# Altium project SQUIDCtr_Rev0.PrjPCB (part 1 of 2)
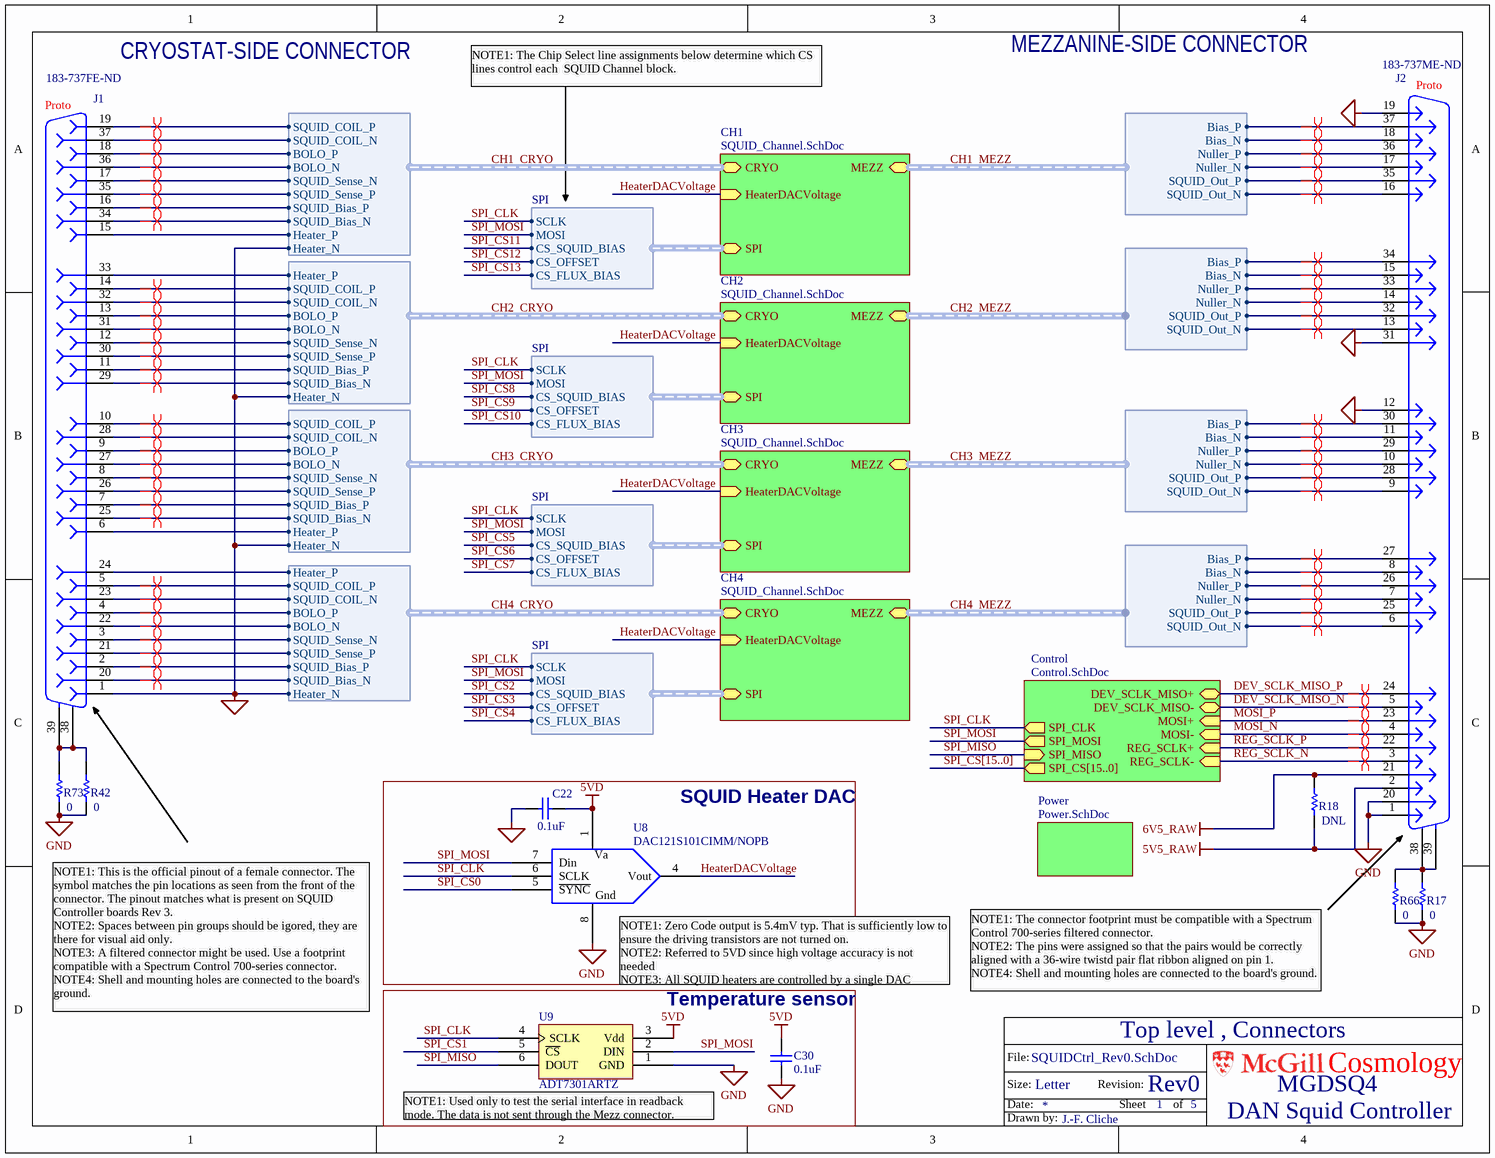
[diagram p0: SQUIDCtrl_Rev0.SchDoc]
ModelNumber: MGDSQ4; ProjectTitle: DAN Squid Controller
5 sheets, 584 parts. Net scope: hierarchical (ports join the sheet entries above them; power ports are global).
Board file: SQUIDCtr_Rev0.PcbDoc
Sheets:
  SQUIDCtrl_Rev0.SchDoc
    CH1 = SQUID_Channel.SchDoc
      REFS = SQUID_Channel_DACS.SchDoc
    Power = Power.SchDoc
    Control = Control.SchDoc
    CH2 = SQUID_Channel.SchDoc
      REFS = SQUID_Channel_DACS.SchDoc
    CH3 = SQUID_Channel.SchDoc
      REFS = SQUID_Channel_DACS.SchDoc
    CH4 = SQUID_Channel.SchDoc
      REFS = SQUID_Channel_DACS.SchDoc

## Sheet SQUIDCtrl_Rev0.SchDoc: Top level , Connectors
size Letter; DrawnBy: J.-F. Cliche; Engineer: J.-F. Cliche; Organization: McGill University; DocumentNumber: 1; Revision: Rev0; SheetNumber: 1; SheetTotal: 5; PageSetup: Record=PageOptions|CenterHorizontal=True|CenterVertical=True|PrintScale=0.96|XCorrection=1.00|YCorrection=1.00|PrintKind=0|BorderSize=5000000|LeftOffset=0|BottomOffset=0|Orientation=2|PaperLength=1000|PaperWidth=1000|Scale=100|PaperSource=7|PrintQuality=-4|MediaType=1|DitherType=10|PaperKind=Letter (8.5 x 11")|PrintScaleMode=1; ProjectTitle: DAN Squid Controller; ProjectName: CSA FMUX

### Parts
C22  0.1uF  [0603]
C30  0.1uF  [0603]
J1  Symbol status: Proto  Supplier Part Number 1: 183-737FE-ND  [DSUB37-F (590mils)]  (hidden comment: DB37F_Resize)
J2  Symbol status: Proto  Supplier Part Number 1: 183-737ME-ND  [DSUB37-M (590mils)]  (hidden comment: DB37M_Resize)
R17  0  [0603]
R18  DNL  [0603]
R42  0  [0603]
R66  0  [0603]
R73  0  [0603]
U8  DAC121S101CIMM/NOPB  [MSOP-8]
U9  ADT7301ARTZ  [SOT23-6]

### Blocks framed on the sheet
SQUID Heater DAC: C22 U8
Temperature sensor: C30 U9

### Sub-sheets
CH1 = SQUID_Channel.SchDoc: CRYO (harness SQUID_CH_IN), MEZZ (harness SQUID_CH_OUT), SPI (harness SPI), HeaterDACVoltage (in)
CH2 = SQUID_Channel.SchDoc: CRYO (harness SQUID_CH_IN), MEZZ (harness SQUID_CH_OUT), SPI (harness SPI), HeaterDACVoltage (in)
CH3 = SQUID_Channel.SchDoc: CRYO (harness SQUID_CH_IN), MEZZ (harness SQUID_CH_OUT), SPI (harness SPI), HeaterDACVoltage (in)
CH4 = SQUID_Channel.SchDoc: CRYO (harness SQUID_CH_IN), MEZZ (harness SQUID_CH_OUT), SPI (harness SPI), HeaterDACVoltage (in)
Control = Control.SchDoc: REG_SCLK+ (in), MOSI+ (in), REG_SCLK- (in), MOSI- (in), DEV_SCLK_MISO+ (bidir), DEV_SCLK_MISO- (bidir), SPI_CLK (out), SPI_MOSI (out), SPI_CS[15..0] (out), SPI_MISO (in)
Power = Power.SchDoc: no entries

### Harnesses
SQUID_CH_IN: SQUID_COIL_P, SQUID_COIL_N, BOLO_P, BOLO_N, SQUID_Sense_P, SQUID_Bias_P, SQUID_Bias_N, Heater_P, SQUID_Sense_N, Heater_N
SQUID_CH_OUT: Bias_P, Bias_N, Nuller_P, Nuller_N, SQUID_Out_P, SQUID_Out_N
SPI: SCLK, MOSI, CS_SQUID_BIAS, CS_OFFSET, CS_FLUX_BIAS

### Nets
5V5_RAW: J2.2 R18.1
5VD: C22.2 C30.2 U8.1(Va) U9.3(Vdd)
6V5_RAW: J2.21 R18.2
GND: C22.1 C30.1 J1.1 J2.1 J2.12 J2.19 J2.20 J2.31 R17.1 R42.1 R66.1 R73.1 U8.8(Gnd) U9.1(GND) ; sheet CH1/CRYO.Heater_N, sheet CH2/CRYO.Heater_N, sheet CH3/CRYO.Heater_N, sheet CH4/CRYO.Heater_N
CH1_CRYO.BOLO_N: J1.36 ; sheet CH1/CRYO.BOLO_N
CH1_CRYO.BOLO_P: J1.18 ; sheet CH1/CRYO.BOLO_P
CH1_CRYO.Heater_P: J1.15 ; sheet CH1/CRYO.Heater_P
CH1_CRYO.SQUID_Bias_N: J1.34 ; sheet CH1/CRYO.SQUID_Bias_N
CH1_CRYO.SQUID_Bias_P: J1.16 ; sheet CH1/CRYO.SQUID_Bias_P
CH1_CRYO.SQUID_COIL_N: J1.37 ; sheet CH1/CRYO.SQUID_COIL_N
CH1_CRYO.SQUID_COIL_P: J1.19 ; sheet CH1/CRYO.SQUID_COIL_P
CH1_CRYO.SQUID_Sense_N: J1.17 ; sheet CH1/CRYO.SQUID_Sense_N
CH1_CRYO.SQUID_Sense_P: J1.35 ; sheet CH1/CRYO.SQUID_Sense_P
CH1_MEZZ.Bias_N: J2.18 ; sheet CH1/MEZZ.Bias_N
CH1_MEZZ.Bias_P: J2.37 ; sheet CH1/MEZZ.Bias_P
CH1_MEZZ.Nuller_N: J2.17 ; sheet CH1/MEZZ.Nuller_N
CH1_MEZZ.Nuller_P: J2.36 ; sheet CH1/MEZZ.Nuller_P
CH1_MEZZ.SQUID_Out_N: J2.16 ; sheet CH1/MEZZ.SQUID_Out_N
CH1_MEZZ.SQUID_Out_P: J2.35 ; sheet CH1/MEZZ.SQUID_Out_P
CH2_CRYO.BOLO_N: J1.31 ; sheet CH2/CRYO.BOLO_N
CH2_CRYO.BOLO_P: J1.13 ; sheet CH2/CRYO.BOLO_P
CH2_CRYO.Heater_P: J1.33 ; sheet CH2/CRYO.Heater_P
CH2_CRYO.SQUID_Bias_N: J1.29 ; sheet CH2/CRYO.SQUID_Bias_N
CH2_CRYO.SQUID_Bias_P: J1.11 ; sheet CH2/CRYO.SQUID_Bias_P
CH2_CRYO.SQUID_COIL_N: J1.32 ; sheet CH2/CRYO.SQUID_COIL_N
CH2_CRYO.SQUID_COIL_P: J1.14 ; sheet CH2/CRYO.SQUID_COIL_P
CH2_CRYO.SQUID_Sense_N: J1.12 ; sheet CH2/CRYO.SQUID_Sense_N
CH2_CRYO.SQUID_Sense_P: J1.30 ; sheet CH2/CRYO.SQUID_Sense_P
CH2_MEZZ.Bias_N: J2.15 ; sheet CH2/MEZZ.Bias_N
CH2_MEZZ.Bias_P: J2.34 ; sheet CH2/MEZZ.Bias_P
CH2_MEZZ.Nuller_N: J2.14 ; sheet CH2/MEZZ.Nuller_N
CH2_MEZZ.Nuller_P: J2.33 ; sheet CH2/MEZZ.Nuller_P
CH2_MEZZ.SQUID_Out_N: J2.13 ; sheet CH2/MEZZ.SQUID_Out_N
CH2_MEZZ.SQUID_Out_P: J2.32 ; sheet CH2/MEZZ.SQUID_Out_P
CH3_CRYO.BOLO_N: J1.27 ; sheet CH3/CRYO.BOLO_N
CH3_CRYO.BOLO_P: J1.9 ; sheet CH3/CRYO.BOLO_P
CH3_CRYO.Heater_P: J1.6 ; sheet CH3/CRYO.Heater_P
CH3_CRYO.SQUID_Bias_N: J1.25 ; sheet CH3/CRYO.SQUID_Bias_N
CH3_CRYO.SQUID_Bias_P: J1.7 ; sheet CH3/CRYO.SQUID_Bias_P
CH3_CRYO.SQUID_COIL_N: J1.28 ; sheet CH3/CRYO.SQUID_COIL_N
CH3_CRYO.SQUID_COIL_P: J1.10 ; sheet CH3/CRYO.SQUID_COIL_P
CH3_CRYO.SQUID_Sense_N: J1.8 ; sheet CH3/CRYO.SQUID_Sense_N
CH3_CRYO.SQUID_Sense_P: J1.26 ; sheet CH3/CRYO.SQUID_Sense_P
CH3_MEZZ.Bias_N: J2.11 ; sheet CH3/MEZZ.Bias_N
CH3_MEZZ.Bias_P: J2.30 ; sheet CH3/MEZZ.Bias_P
CH3_MEZZ.Nuller_N: J2.10 ; sheet CH3/MEZZ.Nuller_N
CH3_MEZZ.Nuller_P: J2.29 ; sheet CH3/MEZZ.Nuller_P
CH3_MEZZ.SQUID_Out_N: J2.9 ; sheet CH3/MEZZ.SQUID_Out_N
CH3_MEZZ.SQUID_Out_P: J2.28 ; sheet CH3/MEZZ.SQUID_Out_P
CH4_CRYO.BOLO_N: J1.22 ; sheet CH4/CRYO.BOLO_N
CH4_CRYO.BOLO_P: J1.4 ; sheet CH4/CRYO.BOLO_P
CH4_CRYO.Heater_P: J1.24 ; sheet CH4/CRYO.Heater_P
CH4_CRYO.SQUID_Bias_N: J1.20 ; sheet CH4/CRYO.SQUID_Bias_N
CH4_CRYO.SQUID_Bias_P: J1.2 ; sheet CH4/CRYO.SQUID_Bias_P
CH4_CRYO.SQUID_COIL_N: J1.23 ; sheet CH4/CRYO.SQUID_COIL_N
CH4_CRYO.SQUID_COIL_P: J1.5 ; sheet CH4/CRYO.SQUID_COIL_P
CH4_CRYO.SQUID_Sense_N: J1.3 ; sheet CH4/CRYO.SQUID_Sense_N
CH4_CRYO.SQUID_Sense_P: J1.21 ; sheet CH4/CRYO.SQUID_Sense_P
CH4_MEZZ.Bias_N: J2.8 ; sheet CH4/MEZZ.Bias_N
CH4_MEZZ.Bias_P: J2.27 ; sheet CH4/MEZZ.Bias_P
CH4_MEZZ.Nuller_N: J2.7 ; sheet CH4/MEZZ.Nuller_N
CH4_MEZZ.Nuller_P: J2.26 ; sheet CH4/MEZZ.Nuller_P
CH4_MEZZ.SQUID_Out_N: J2.6 ; sheet CH4/MEZZ.SQUID_Out_N
CH4_MEZZ.SQUID_Out_P: J2.25 ; sheet CH4/MEZZ.SQUID_Out_P
DEV_SCLK_MISO_N: J2.5 ; sheet Control/DEV_SCLK_MISO-
DEV_SCLK_MISO_P: J2.24 ; sheet Control/DEV_SCLK_MISO+
HeaterDACVoltage: U8.4(Vout) ; sheet CH1/HeaterDACVoltage, sheet CH2/HeaterDACVoltage, sheet CH3/HeaterDACVoltage, sheet CH4/HeaterDACVoltage
MOSI_N: J2.4 ; sheet Control/MOSI-
MOSI_P: J2.23 ; sheet Control/MOSI+
REG_SCLK_N: J2.3 ; sheet Control/REG_SCLK-
REG_SCLK_P: J2.22 ; sheet Control/REG_SCLK+
SPI_CLK: U8.6(SCLK) U9.4(SCLK) ; sheet Control/SPI_CLK, sheet CH1/SPI.SCLK, sheet CH2/SPI.SCLK, sheet CH3/SPI.SCLK, sheet CH4/SPI.SCLK
SPI_CS0: U8.5(~{SYNC})
SPI_CS1: U9.5(~{CS})
SPI_MISO: U9.6(DOUT) ; sheet Control/SPI_MISO
SPI_MOSI: U8.7(Din) U9.2(DIN) ; sheet Control/SPI_MOSI, sheet CH1/SPI.MOSI, sheet CH2/SPI.MOSI, sheet CH3/SPI.MOSI, sheet CH4/SPI.MOSI
NetJ1_38: J1.38(MH1) J1.39(MH2) R42.2 R73.2
NetJ2_38: J2.38(MH1) J2.39(MH2) R17.2 R66.2

Not connected (* = marked no-connect by the designer): U8 2(NC) 3(NC)

### Buses and harness runs
bus SPI_CS[15..0] = sheet Control/SPI_CS[15..0]
harness CH1_CRYO = sheet CH1/CRYO
harness CH1_MEZZ = sheet CH1/MEZZ
harness CH2_CRYO = sheet CH2/CRYO
harness CH2_MEZZ = sheet CH2/MEZZ
harness CH3_CRYO = sheet CH3/CRYO
harness CH3_MEZZ = sheet CH3/MEZZ
harness CH4_CRYO = sheet CH4/CRYO
harness CH4_MEZZ = sheet CH4/MEZZ

### Layout directives
differential pair: CH1_CRYO.BOLO_N, CH1_CRYO.BOLO_P, CH1_CRYO.SQUID_Bias_N, CH1_CRYO.SQUID_Bias_P, CH1_CRYO.SQUID_COIL_N, CH1_CRYO.SQUID_COIL_P, CH1_CRYO.SQUID_Sense_N, CH1_CRYO.SQUID_Sense_P, CH1_MEZZ.Bias_N, CH1_MEZZ.Bias_P, CH1_MEZZ.Nuller_N, CH1_MEZZ.Nuller_P, CH1_MEZZ.SQUID_Out_N, CH1_MEZZ.SQUID_Out_P, CH2_CRYO.BOLO_N, CH2_CRYO.BOLO_P, CH2_CRYO.SQUID_Bias_N, CH2_CRYO.SQUID_Bias_P, CH2_CRYO.SQUID_COIL_N, CH2_CRYO.SQUID_COIL_P, CH2_CRYO.SQUID_Sense_N, CH2_CRYO.SQUID_Sense_P, CH2_MEZZ.Bias_N, CH2_MEZZ.Bias_P, CH2_MEZZ.Nuller_N, CH2_MEZZ.Nuller_P, CH2_MEZZ.SQUID_Out_N, CH2_MEZZ.SQUID_Out_P, CH3_CRYO.BOLO_N, CH3_CRYO.BOLO_P, CH3_CRYO.SQUID_Bias_N, CH3_CRYO.SQUID_Bias_P, CH3_CRYO.SQUID_COIL_N, CH3_CRYO.SQUID_COIL_P, CH3_CRYO.SQUID_Sense_N, CH3_CRYO.SQUID_Sense_P, CH3_MEZZ.Bias_N, CH3_MEZZ.Bias_P, CH3_MEZZ.Nuller_N, CH3_MEZZ.Nuller_P, CH3_MEZZ.SQUID_Out_N, CH3_MEZZ.SQUID_Out_P, CH4_CRYO.BOLO_N, CH4_CRYO.BOLO_P, CH4_CRYO.SQUID_Bias_N, CH4_CRYO.SQUID_Bias_P, CH4_CRYO.SQUID_COIL_N, CH4_CRYO.SQUID_COIL_P, CH4_CRYO.SQUID_Sense_N, CH4_CRYO.SQUID_Sense_P, CH4_MEZZ.Bias_N, CH4_MEZZ.Bias_P, CH4_MEZZ.Nuller_N, CH4_MEZZ.Nuller_P, CH4_MEZZ.SQUID_Out_N, CH4_MEZZ.SQUID_Out_P, DEV_SCLK_MISO_N, DEV_SCLK_MISO_P, MOSI_N, MOSI_P, REG_SCLK_N, REG_SCLK_P

### Notes on the sheet
- CRYOSTAT-SIDE CONNECTOR
- NOTE1: The Chip Select line assignments below determine which CS lines control each  SQUID Channel block.
- MEZZANINE-SIDE CONNECTOR
- NOTE1: This is the official pinout of a female connector. The symbol matches the pin locations as seen from the front of the connector. The pinout matches what is present on SQUID Controller boards Rev 3.
  NOTE2: Spaces between pin groups should be igored, they are there for visual aid only.
  NOTE3: A filtered connector might be used. Use a footprint compatible with a Spectrum Control 700-series connector.
  NOTE4: Shell and mounting holes are connected to the board's ground.
- (near U8) NOTE1: Zero Code output is 5.4mV typ. That is sufficiently low to ensure the driving transistors are not turned on.
  NOTE2: Referred to 5VD since high voltage accuracy is not needed
  NOTE3: All SQUID heaters are controlled by a single DAC
- NOTE1: The connector footprint must be compatible with a Spectrum Control 700-series filtered connector.
  NOTE2: The pins were assigned so that the pairs would be correctly aligned with a 36-wire twistd pair flat ribbon aligned on pin 1.
  NOTE4: Shell and mounting holes are connected to the board's ground.
- (near U9) NOTE1: Used only to test the serial interface in readback mode. The data is not sent through the Mezz connector.
- File:
- Size:
- Date:
- Letter
- Revision:
- Sheet
- of
- Cosmology
- Drawn by:

### Library data of the parts
C22 C30 = Cap0603: Capacitor, Ceramic, 0603; Part Constraints: 0.1uF 16V 10% X7R; Manufacturer: Generic; Supplier 1: Digi-Key; Supplier Part Number 1: 399-1096-1-ND; Value: 0.1uF
J1 = DB37F_Resize: DB37F; Manufacturer: Generic; Part Constraints: CONN DB37 FEMALE .590" R/A; Supplier 1: Digi-Key
J2 = DB37M_Resize: DB37M; Manufacturer: Generic; Part Constraints: CONN DB37 MALE .590" R/A; Supplier 1: Digi-Key
R17 R42 R66 R73 = RES 0603: Manufacturer: Generic; Manufacturer Part Number 1: e.g CRCW0603 series; Part constraints: 0 1/10W 1% 100ppm/C 0603; Value: 0; Supplier 1: Digi-Key; Supplier Part Number 1: 541-0.0GCT-ND
R18 = RES 0603: Manufacturer: Generic; Manufacturer Part Number 1: e.g CRCW0603 series; Value: DNL; Part constraints: DNL
U8 = DAC121S101: CONV D/A 12BIT MICROPWR 8MSOP; Manufacturer: National Semiconductor; Part Constraints: DS90C032TMX/NOPB; Settling Time: 12µs; Number of Bits: 12; Data Interface: DSP, MICROWIRE™, QSPI™, Serial, SPI™; Number of Converters: 1; Voltage Supply Source: Single Supply; Power Dissipation (Max): 1.72mW; Number of Outputs and Type: 1 Voltage, Unipolar; 1 Voltage, Bipolar; RoHS: RoHS Compliant; Category: Integrated Circuits (ICs); Stock 1: 3011; Pricing 1: 1=3.5, 25=2.8616, 100=2.5698, 250=2.33624, 500=2.0442 (CAD); Operating Temperature: -40°C ~ 105°C; Mounting Type: Surface Mount; Package / Case: 8-TSSOP, 8-MSOP (0.118", 3.00mm Width); Supplier Device Package: 8-MSOP; Packaging: Cut Tape (CT); Sampling Rate (Per Second): *; ComponentLink1URL: http://www.ti.com/lit/ds/symlink/dac121s101.pdf; ComponentLink1Description: http://www.ti.com/lit/ds/symlink/dac121s101.pdf; Supplier 1: Digi-Key; Supplier Part Number 1: DAC121S101CIMMCT-ND
U9 = ADT7301: Digital Temperature Sensor, 13-Bit, +/-1 Degree Accurate; Manufacturer: Analog Devices; Footprint: *; TechInfo: *; Part constraints: ADT7301ARTZ; Supplier 1: Digi-Key; Supplier Part Number 1: ADT7301ARTZ-REEL7CT-ND

## Sheet SQUID_Channel.SchDoc: Analog chain
size Letter; DrawnBy: J.-F. Cliche; Engineer: J.-F. Cliche; DocumentNumber: 2; Revision: Rev0; SheetNumber: 2; SheetTotal: 5; ProjectTitle: DAN Squid Controller
Used 4 times, as channels CH1, CH2, CH3, CH4. Parts and nets are listed once, with the designators drawn on the sheet.
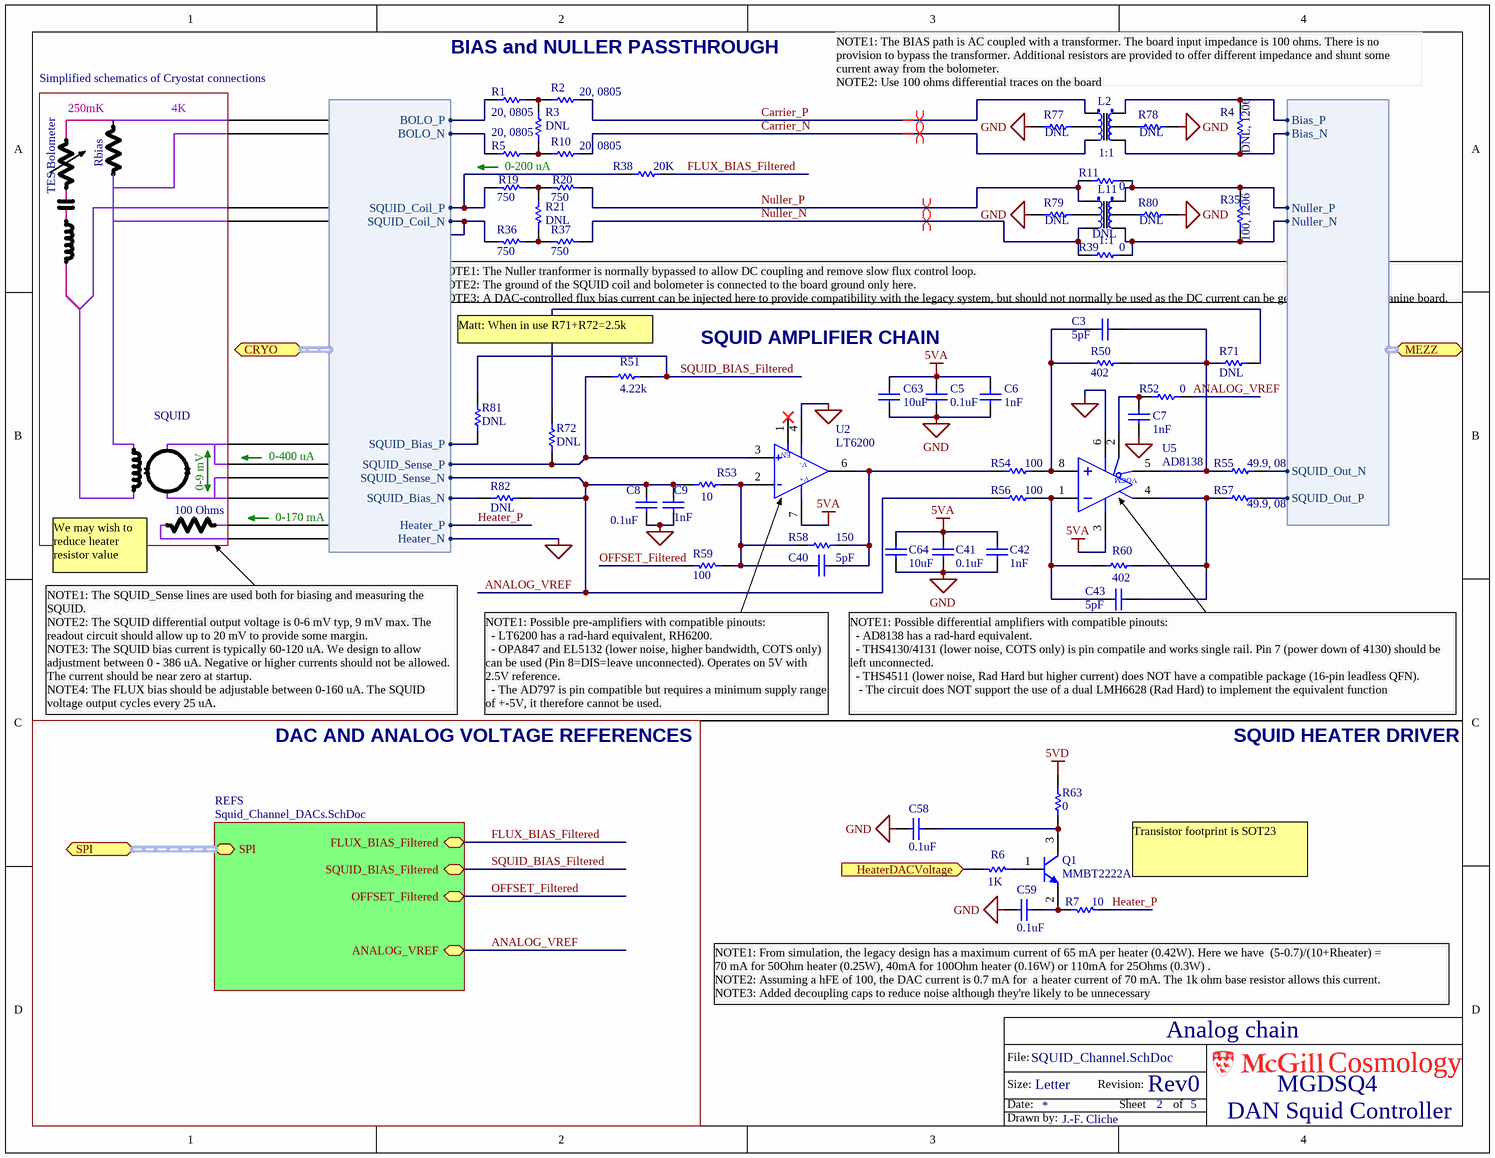
[diagram p1: SQUID_Channel.SchDoc]

### Parts
C3  5pF  [0603]
C5  0.1uF  [0603]
C6  1nF  [0603]
C7  1nF  [0603]
C8  0.1uF  [0603]
C9  1nF  [0603]
C40  5pF  [0603]
C41  0.1uF  [0603]
C42  1nF  [0603]
C43  5pF  [0603]
C58  0.1uF  [0603]
C59  0.1uF  [0603]
C63  value 10uF  [CC3225-1210]  (hidden comment: 10uF, 1210)
C64  value 10uF  [CC3225-1210]  (hidden comment: 10uF, 1210)
L2  Transformer  [TTWB]  (value not drawn)
L11  DNL  [TTWB]
Q1  MMBT2222A  [SOT23]
R1  20, 0805  [0805]
R2  20, 0805  [0805]
R3  DNL  [0805]
R4  DNL, 1206  [1206]
R5  20, 0805  [0805]
R6  1k  [0603]
R7  10  [0603]
R10  20, 0805  [0805]
R11  0  [0603]
R19  750  [0603]
R20  750  [0603]
R21  DNL  [0603]
R35  100, 1206  [1206]
R36  750  [0603]
R37  750  [0603]
R38  20k  [0603]
R39  0  [0603]
R48  0  [0603]
R50  402  [0603]
R51  4.22k  [0603]
R52  0  [0603]
R53  10  [0603]
R54  100  [0603]
R55  49.9, 0805  [0805]
R56  100  [0603]
R57  49.9, 0805  [0805]
R58  150  [0603]
R59  100  [0603]
R60  402  [0603]
R63  0  [0603]
R71  DNL  [0603]
R72  DNL  [0603]
R77  DNL  [0603]
R78  DNL  [0603]
R79  DNL  [0603]
R80  DNL  [0603]
R81  DNL  [0603]
R82  DNL  [0603]
U2  LT6200  [SO8]
U5  AD8138  [SO8]

### Sub-sheets
REFS = Squid_Channel_DACs.SchDoc: SPI (harness SPI), FLUX_BIAS_Filtered, SQUID_BIAS_Filtered, OFFSET_Filtered, ANALOG_VREF

### Ports
CRYO (harness SQUID_CH_IN), HeaterDACVoltage (in), MEZZ (harness SQUID_CH_OUT), SPI (harness SPI)

### Harnesses
SQUID_CH_IN: SQUID_Coil_P, SQUID_Coil_N, BOLO_P, BOLO_N, SQUID_Bias_P, SQUID_Sense_P, SQUID_Sense_N, Heater_P, SQUID_Bias_N, Heater_N
SQUID_CH_OUT: Bias_P, Bias_N, Nuller_P, Nuller_N, SQUID_Out_P, SQUID_Out_N

### Nets
5VA: C5.2 C6.2 C41.2 C42.2 C63.2 C64.2 U2.7(V+) U5.3(V+)
5VD: R63.1
GND: C5.1 C6.1 C7.1 C8.1 C9.1 C41.1 C42.1 C58.2 C59.2 C63.1 C64.1 R48.2 R77.1 R78.2 R79.1 R80.2 U2.4(V-) U5.6(V-) ; port CRYO.Heater_N
ANALOG_VREF: C8.2 C9.2 R52.1 R53.2 R56.2 R82.2 ; sheet REFS/ANALOG_VREF, port CRYO.SQUID_Sense_N
Carrier_N: L2.3(Prim) R10.1
Carrier_P: L2.1(PrimDot) R2.1
FLUX_BIAS_Filtered: R38.1 ; sheet REFS/FLUX_BIAS_Filtered
Heater_P: R7.1 ; port CRYO.Heater_P
HeaterDACVoltage: R6.2 ; port HeaterDACVoltage
Nuller_N: L11.3(Prim) R37.2 R39.2
Nuller_P: L11.1(PrimDot) R11.2 R20.2
OFFSET_Filtered: R59.1 ; sheet REFS/OFFSET_Filtered
SQUID_BIAS_Filtered: R51.1 R81.1 ; sheet REFS/SQUID_BIAS_Filtered
NetC3_1: C3.1 R50.1 R55.1 R71.1 U5.5(OUT-)
NetC3_2: C3.2 R50.2 R54.1 U5.8(IN+)
NetC7_2: C7.2 R52.2 U5.2(VOCM)
NetC40_1: C40.1 R54.2 R58.1 U2.6(OUT-)
NetC40_2: C40.2 R53.1 R58.2 R59.2 U2.2(IN-)
NetC43_1: C43.1 R57.1 R60.1 U5.4(OUT+)
NetC43_2: C43.2 R56.1 R60.2 U5.1(IN-)
NetC58_1: C58.1 Q1.3(C) R63.2
NetC59_1: C59.1 Q1.2(E) R7.2
NetL2_2: L2.2(PrimCent) R77.2
NetL2_4: L2.4(Sec) R4.2 ; port MEZZ.Bias_N
NetL2_5: L2.5(SecCent) R78.1
NetL2_6: L2.6(SecDot) R4.1 ; port MEZZ.Bias_P
NetL11_2: L11.2(PrimCent) R79.2
NetL11_4: L11.4(Sec) R35.2 R39.1 ; port MEZZ.Nuller_N
NetL11_5: L11.5(SecCent) R80.1
NetL11_6: L11.6(SecDot) R11.1 R35.1 ; port MEZZ.Nuller_P
NetQ1_1: Q1.1(B) R6.1
NetR1_1: R1.1 ; port CRYO.BOLO_P
NetR1_2: R1.2 R2.2 R3.1
NetR3_2: R3.2 R5.2 R10.2
NetR5_1: R5.1 ; port CRYO.BOLO_N
NetR19_1: R19.1 R20.1 R21.1
NetR19_2: R19.2 R38.2 ; port CRYO.SQUID_Coil_P
NetR21_2: R21.2 R36.1 R37.1
NetR36_2: R36.2 R48.1 ; port CRYO.SQUID_Coil_N
NetR51_2: R51.2 R72.2 U2.3(IN+) ; port CRYO.SQUID_Sense_P
NetR55_2: R55.2 ; port MEZZ.SQUID_Out_N
NetR57_2: R57.2 ; port MEZZ.SQUID_Out_P
NetR71_2: R71.2 R72.1
NetR81_2: R81.2 ; port CRYO.SQUID_Bias_P
NetR82_1: R82.1 ; port CRYO.SQUID_Bias_N

Not connected (* = marked no-connect by the designer): U2 1(SHDN)*; U5 7(NC)

### Channels
CH1: designators end in _1; ports HeaterDACVoltage=HeaterDACVoltage
CH2: designators end in _2; ports HeaterDACVoltage=HeaterDACVoltage
CH3: designators end in _3; ports HeaterDACVoltage=HeaterDACVoltage
CH4: designators end in _4; ports HeaterDACVoltage=HeaterDACVoltage

### Buses and harness runs
harness port SPI = sheet REFS/SPI

### Layout directives
differential pair: Carrier_N_CH1, Carrier_P_CH1, Nuller_N_CH1, Nuller_P_CH1

### Notes on the sheet
- Simplified schematics of Cryostat connections
- BIAS and NULLER PASSTHROUGH
- NOTE1: The BIAS path is AC coupled with a transformer. The board input impedance is 100 ohms. There is no provision to bypass the transformer. Additional resistors are provided to offer different impedance and shunt some current away from the bolometer.
  NOTE2: Use 100 ohms differential traces on the board
- 250mK
- Rbias
- 4K
- (near L2) 1:1
- TES Bolometer
- 0-200 uA
- (near R39) NOTE1: The Nuller tranformer is normally bypassed to allow DC coupling and remove slow flux control loop.
  NOTE2: The ground of the SQUID coil and bolometer is connected to the board ground only here.
  NOTE3: A DAC-controlled flux bias current can be injected here to provide compatibility with the legacy system, but should not normally be used as the DC current can be generated on the Mezzanine board.
- 1:1
- (near R51) Matt: When in use R71+R72=2.5k
- SQUID AMPLIFIER CHAIN
- SQUID
- 0-9 mV
- 0-400 uA
- We may wish to reduce heater resistor value
- 100 Ohms
- 0-170 mA
- NOTE1: The SQUID_Sense lines are used both for biasing and measuring the SQUID.
  NOTE2: The SQUID differential output voltage is 0-6 mV typ, 9 mV max. The readout circuit should allow up to 20 mV to provide some margin.
  NOTE3: The SQUID bias current is typically 60-120 uA. We design to allow adjustment between 0 - 386 uA. Negative or higher currents should not be allowed. The current should be near zero at startup.
  NOTE4: The FLUX bias should be adjustable between 0-160 uA. The SQUID voltage output cycles every 25 uA.
- DAC AND ANALOG VOLTAGE REFERENCES
- NOTE1: Possible pre-amplifiers with compatible pinouts:
  - LT6200 has a rad-hard equivalent, RH6200.
  - OPA847 and EL5132 (lower noise, higher bandwidth, COTS only) can be used (Pin 8=DIS=leave unconnected). Operates on 5V with 2.5V reference.
  - The AD797 is pin compatible but requires a minimum supply range of +-5V, it therefore cannot be used.
- (near C43) NOTE1: Possible differential amplifiers with compatible pinouts:
  - AD8138 has a rad-hard equivalent.
  - THS4130/4131 (lower noise, COTS only) is pin compatile and works single rail. Pin 7 (power down of 4130) should be left unconnected.
  - THS4511 (lower noise, Rad Hard but higher current) does NOT have a compatible package (16-pin leadless QFN).
  - The circuit does NOT support the use of a dual LMH6628 (Rad Hard) to implement the equivalent function
- SQUID HEATER DRIVER
- Transistor footprint is SOT23
- NOTE1: From simulation, the legacy design has a maximum current of 65 mA per heater (0.42W). Here we have  (5-0.7)/(10+Rheater) =
  70 mA for 50Ohm heater (0.25W), 40mA for 100Ohm heater (0.16W) or 110mA for 25Ohms (0.3W) .
  NOTE2: Assuming a hFE of 100, the DAC current is 0.7 mA for  a heater current of 70 mA. The 1k ohm base resistor allows this current.
  NOTE3: Added decoupling caps to reduce noise although they're likely to be unnecessary
- File:
- Size:
- Date:
- Letter
- Revision:
- Sheet
- of
- Cosmology
- Drawn by:
- (in symbol LT6200) EN

### Library data of the parts
C3 C40 C43 = Cap0603: Capacitor, Ceramic, 0603; Part Constraints: 5pF 50V +-0.25pF COG/NPO 0603; Manufacturer: Generic; Value: 5pF; Supplier 1: Digi-Key; Supplier Part Number 1: 490-1390-1-ND
C5 C8 C41 C58 C59 = Cap0603: as C22 on sheet SQUIDCtrl_Rev0; Supplier 1: Digi-Key; Supplier Part Number 1: 399-1096-1-ND; Value: 0.1uF
C6 C7 C9 C42 = Cap0603: Capacitor, Ceramic, 0603; Part Constraints: 1nF 50V 10% X7R 0603; Manufacturer: Generic; Value: 1nF; Supplier 1: Digi-Key; Supplier Part Number 1: 399-1082-1-ND
C63 C64 = CAP 1210: Capacitor, Ceramic, 1210; Manufacturer Part Number: 1206YD106KAT2A; Manufacturer: AVX Corporation; Part Constraints: 10uF 1210 16V X5R <=1.78mm height; Voltage: 16V; Footprint: 1210; Supplier 1: Digikey; Supplier Part Number 1: 478-1573-1-ND
L2 L11 = Transformer: Manufacturer: Coilcraft; Part Constraints: TTWB2010LD; Supplier 1: Coilcraft; Supplier Part Number 1: TTWB2010LD
Q1 = 2N2222: TRANS NPN 40V 350MW SMD SOT23-3; Manufacturer: Diodes Inc; Part Constraints: MMBT2222A-FDICT-ND; Supplier 1: Digi-Key; Supplier Part Number 1: MMBT2222A-FDICT-ND
R1 R2 R5 R10 = RES 0805: RES 0805 SMD; Manufacturer: Generic; Value: 20; Part constraints: 20, 0805; Supplier 1: Digi-Key; Supplier Part Number 1: P20.0CCT-ND
R3 = RES 0805: RES 0805 SMD; Manufacturer: Generic; Value: DNL; Part constraints: DNL, 0805
R4 = RES 1206: RES 100 OHM 1/4W 1206 SMD; Manufacturer: Rohm Semiconductor; Value: DNL; Manufacturers Part Number: DNL; Part constraints: DNL; Supplier 1: Digi-Key; Supplier Part Number 1: RHM100AFCT-ND
R6 = RES 0603: Manufacturer: Generic; Manufacturer Part Number 1: e.g CRCW0603 series; Part constraints: 1K 1/10W 1% 100ppm/C 0603; Value: 1K; Supplier 1: Digi-Key; Supplier Part Number 1: 541-1.00KHTR-ND
R7 = RES 0603: Manufacturer: Generic; Part constraints: RES 10.0 OHM 1/10W 1% 0603 SMD; Manufacturer Part Number 1: e.g CRCW0603 series; Value: 10; Supplier 1: Digi-Key; Supplier Part Number 1: 541-10.0HCT-ND
R11 R39 R48 R52 R63 R77-R80 = Res0603: RES 0603; Manufacturer: Generic; Part constraints: 0 1/10W 1% 100ppm/C 0603; Manufacturer Part Number 1: e.g CRCW0603 series; Supplier 1: Digi-Key; Supplier Part Number 1: 541-0.0GCT-ND
  R11 R39 R48 R52 R63: Value: 0
  R77-R80: Value: DNL
R19 R20 R36 R37 = Res0603: RES 0603; Manufacturer: Generic; Manufacturer Part Number 1: e.g CRCW0603 series; Part constraints: 750 1/10W 1% 100ppm/C 0603; Value: 750; Supplier 1: Digi-Key; Supplier Part Number 1: 541-750HCT-ND
R21 R71 R72 R81 R82 = Res0603: RES 0603; Manufacturer: Generic; Manufacturer Part Number 1: e.g CRCW0603 series; Value: DNL; Part constraints: DNL
  R21: Supplier 1: Digi-Key; Supplier Part Number 1: 541-750HCT-ND
R35 = RES 1206: RES 100 OHM 1/4W 1206 SMD; Manufacturers Part Number: ESR18EZPF1000; Manufacturer: Rohm Semiconductor; Part constraints: 100 Ohm, 1206, 100ppm, 1%, 1/3W; Value: 100; Supplier 1: Digi-Key; Supplier Part Number 1: RHM100AFCT-ND
R38 = Res0603: RES 0603; Manufacturer: Generic; Part constraints: 20K 1/10W 1% 100ppm/C 0603; Manufacturer Part Number 1: e.g CRCW0603 series; Value: 20K; Supplier 1: Digi-Key; Supplier Part Number 1: 541-20.0KHCT-ND
R50 = RES 0603: Manufacturer: Generic; Part constraints: 402 1/10W 1% 100ppm/C 0603; Manufacturer Part Number 1: e.g CRCW0603 series; Value: 402; Supplier 1: Digi-Key; Supplier Part Number 1: 541-402HCT-ND
R51 = Res0603: RES 0603; Manufacturer: Generic; Part constraints: 4.22K 1/10W 1% 100ppm/C 0603; Manufacturer Part Number 1: e.g CRCW0603 series; Value: 4.22k; Supplier 1: Digi-Key; Supplier Part Number 1: 541-4.22KHCT-ND
R53 = Res0603: RES 0603; Manufacturer: Generic; Part constraints: RES 10.0 OHM 1/10W 1% 0603 SMD; Manufacturer Part Number 1: e.g CRCW0603 series; Value: 10; Supplier 1: Digi-Key; Supplier Part Number 1: 541-10.0HCT-ND
R54 R56 R59 = Res0603: RES 0603; Manufacturer: Generic; Part constraints: RES 100 OHM 1/10W 1% 0603 SMD; Manufacturer Part Number 1: e.g CRCW0603 series; Value: 100; Supplier 1: Digi-Key; Supplier Part Number 1: 541-100HCT-ND
R55 R57 = RES 0805: RES 0805 SMD; Manufacturer: Generic; Part constraints: 49.9, 0805, 100ppm, 1%; Value: 49.9; Supplier 1: Digi-Key; Supplier Part Number 1: 541-49.9TCT-ND
R58 = Res0603: RES 0603; Part Constraints: 150 OHM 1/10W 1% 0603; Manufacturer: Generic; Manufacturer Part Number 1: e.g CRCW0603 series; Value: 150; Supplier 1: Digi-Key; Supplier Part Number 1: 541-150HCT-ND
R60 = Res0603: RES 0603; Manufacturer: Generic; Part constraints: 402 1/10W 1% 100ppm/C 0603; Manufacturer Part Number 1: e.g CRCW0603 series; Value: 402; Supplier 1: Digi-Key; Supplier Part Number 1: 541-402HCT-ND
U2 = LT6200: IC OPAMP R-R I/O 165MHZ 8-SOIC; Manufacturer: Linear Technology; Part Constraints: LT6200IS8#PBF-ND; Amplifier Type: Buffer; Number of Circuits: 1; Output Type: Rail-to-Rail; Slew Rate: 50 V/µs; Current - Input Bias: 23µA; Voltage - Input Offset: 2500µV; Current - Supply: 20mA; Current - Output / Channel: 90mA; Voltage - Supply, Single/Dual (±): 2.5 V ~ 12.6 V, ±1.25 V ~ 6.3 V; RoHS: RoHS Compliant; Category: Integrated Circuits (ICs); Stock 1: 1263; Pricing 1: 1=4.72, 25=3.1288, 100=2.572 (CAD); Gain Bandwidth Product: 165MHz; -3db Bandwidth: -; Operating Temperature: 0°C ~ 70°C; Mounting Type: Surface Mount; Package / Case: 8-SOIC (0.154", 3.90mm Width); Supplier Device Package: 8-SO; Packaging: Tube; ComponentLink1URL: http://www.linear.com/docs/3869; ComponentLink1Description: http://www.linear.com/docs/3869; Supplier 1: Digi-Key; Supplier Part Number 1: LT6200IS8#PBF-ND
U5 = AD8138: IC AMP DIFF LDIST LP 95MA 8SOIC; Manufacturer: Analog Devices Inc; Part Constraints: AD8138ARZ; RoHS: RoHS Compliant; Category: Integrated Circuits (ICs); Stock 1: 1339; Pricing 1: 1=9.41, 25=7.7196, 100=6.9662, 250=6.40144, 500=5.83662, 1000=5.0835, 2500=4.89522, 5000=4.74211 (CAD); Type: ADC Driver; Applications: Data Acquisition; Mounting Type: Surface Mount; Package / Case: 8-SOIC (0.154", 3.90mm Width); Supplier Device Package: 8-SOIC; Packaging: Tube; ComponentLink1URL: http://www.analog.com/static/imported-files/data_sheets/AD8138.pdf; ComponentLink1Description: http://www.analog.com/static/imported-files/data_sheets/AD8138.pdf; Supplier 1: Digi-Key; Supplier Part Number 1: AD8138ARZ-ND

## Sheet SQUID_Channel_DACS.SchDoc: References and DACs
size Letter; PageSetup: Record=PageOptions|CenterHorizontal=True|CenterVertical=True|PrintScale=1.00|XCorrection=1.00|YCorrection=1.00|PrintKind=1|BorderSize=5000000|LeftOffset=0|BottomOffset=0|Orientation=2|PaperLength=1000|PaperWidth=1000|Scale=100|PaperSource=7|PrintQuality=-4|MediaType=1|DitherType=10|PaperKind=Letter|PrintScaleMode=1; Author: Adam Gilbert; CompanyName: McGill University; DrawnBy: J.-F. Cliche; Organization: Altium Limited; Address1: McGill Cosmology; Address2: 3600 University Street; Address3: Montreal, Quebec; Address4: Canada; DocumentNumber: 3; Revision: Rev0; SheetNumber: 3; SheetTotal: 5; ProjectTitle: DAN Squid Controller; ProjectName: DAN Squid Controller
Used 4 times, as channels CH1/REFS, CH2/REFS, CH3/REFS, CH4/REFS. Parts and nets are listed once, with the designators drawn on the sheet.
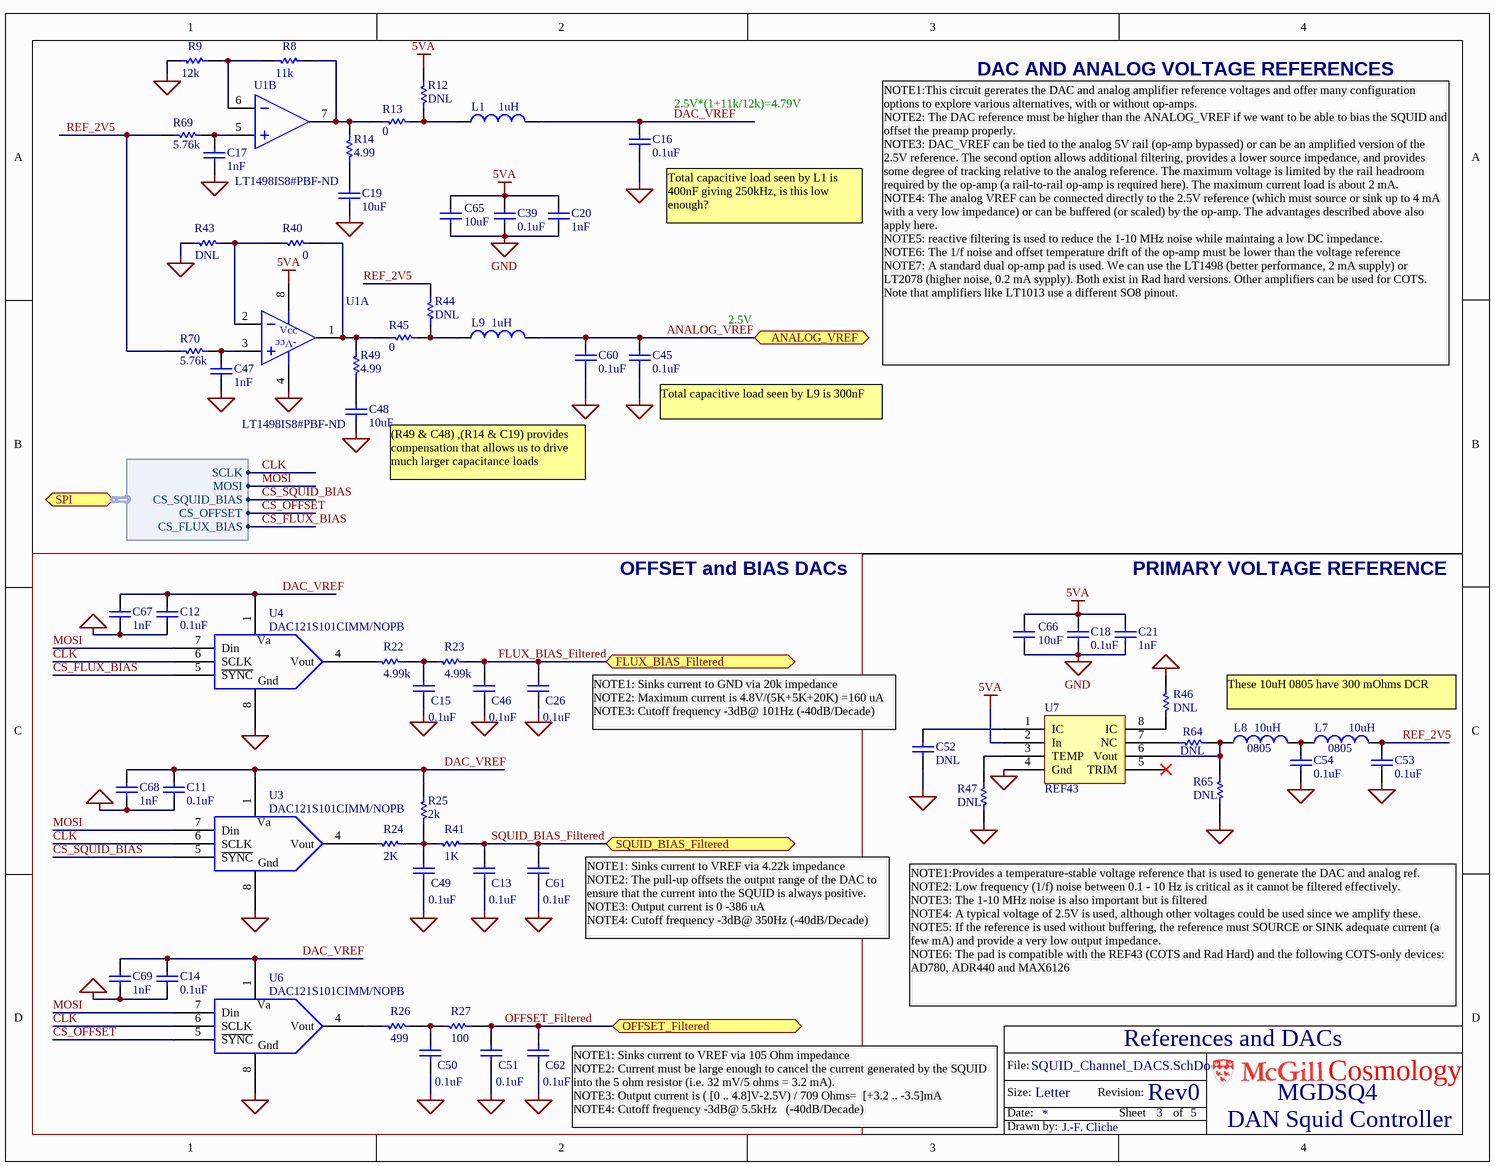
[diagram p2: SQUID_Channel_DACS.SchDoc]

### Parts
C11  0.1uF  [0603]
C12  0.1uF  [0603]
C13  0.1uF  [0603]
C14  0.1uF  [0603]
C15  0.1uF  [0603]
C16  0.1uF  [0603]
C17  1nF  [0603]
C18  0.1uF  [0603]
C19  10uF  [0603]
C20  1nF  [0603]
C21  1nF  [0603]
C26  0.1uF  [0603]
C39  0.1uF  [0603]
C45  0.1uF  [0603]
C46  0.1uF  [0603]
C47  1nF  [0603]
C48  10uF  [0603]
C49  0.1uF  [0603]
C50  0.1uF  [0603]
C51  0.1uF  [0603]
C52  DNL  [0603]
C53  0.1uF  [0603]
C54  0.1uF  [0603]
C60  0.1uF  [0603]
C61  0.1uF  [0603]
C62  0.1uF  [0603]
C65  value 10uF  [CC3225-1210]  (hidden comment: 10uF, 1210)
C66  value 10uF  [CC3225-1210]  (hidden comment: 10uF, 1210)
C67  1nF  [0603]
C68  1nF  [0603]
C69  1nF  [0603]
L1  value 1uH  [0603]
L7  10uH  [0805]
L8  10uH  [0805]
L9  value 1uH  [0603]
R8  11k  [0603]
R9  12k  [0603]
R12  DNL  [0603]
R13  0  [0603]
R14  4.99  [0603]
R22  4.99k  [0603]
R23  4.99k  [0603]
R24  2k  [0603]
R25  2k  [0603]
R26  499  [0603]
R27  100  [0603]
R40  0  [0603]
R41  1k  [0603]
R43  DNL  [0603]
R44  DNL  [0603]
R45  0  [0603]
R46  DNL  [0603]
R47  DNL  [0603]
R49  4.99  [0603]
R64  DNL  [0603]
R65  DNL  [0603]
R69  5.76k  [0603]
R70  5.76k  [0603]
U1  LT1498IS8#PBF-ND  [SO8]  (parts A,B of 2)
U3  DAC121S101CIMM/NOPB  [MSOP-8]
U4  DAC121S101CIMM/NOPB  [MSOP-8]
U6  DAC121S101CIMM/NOPB  [MSOP-8]
U7  REF43  [SO8]

### Blocks framed on the sheet
OFFSET and BIAS DACs: C11-C15 C26 C46 C49-C51 C61 C62 C67-C69 R22-R27 R41 U3 U4 U6

### Ports
ANALOG_VREF, FLUX_BIAS_Filtered, OFFSET_Filtered, SPI (harness SPI), SQUID_BIAS_Filtered

### Harnesses
SPI: SCLK, MOSI, CS_SQUID_BIAS, CS_OFFSET, CS_FLUX_BIAS

### Nets
5VA: C18.2 C20.2 C21.2 C39.2 C65.2 C66.2 R12.1 U1.8(VDD) U7.2(In)
GND: C11.2 C12.2 C13.2 C14.1 C15.2 C16.1 C17.1 C18.1 C19.1 C20.1 C21.1 C26.2 C39.1 C45.1 C46.2 C47.1 C48.1 C49.2 C50.2 C51.2 C52.1 C53.1 C54.1 C60.1 C61.2 C62.2 C65.1 C66.1 C67.1 C68.1 C69.1 R9.2 R43.2 R46.2 R47.1 R65.1 U1.4(GND) U3.8(Gnd) U4.8(Gnd) U6.8(Gnd) U7.4(Gnd)
ANALOG_VREF: C45.2 C60.2 L9.1 ; port ANALOG_VREF
CLK: U3.6(SCLK) U4.6(SCLK) U6.6(SCLK) ; port SPI.SCLK
CS_FLUX_BIAS: U4.5(~{SYNC}) ; port SPI.CS_FLUX_BIAS
CS_OFFSET: U6.5(~{SYNC}) ; port SPI.CS_OFFSET
CS_SQUID_BIAS: U3.5(~{SYNC}) ; port SPI.CS_SQUID_BIAS
DAC_VREF: C11.1 C12.1 C14.2 C16.2 C67.2 C68.2 C69.2 L1.1 R25.2 U3.1(Va) U4.1(Va) U6.1(Va)
FLUX_BIAS_Filtered: C26.1 C46.1 R23.2 ; port FLUX_BIAS_Filtered
MOSI: U3.7(Din) U4.7(Din) U6.7(Din) ; port SPI.MOSI
OFFSET_Filtered: C51.1 C62.1 R27.2 ; port OFFSET_Filtered
REF_2V5: C53.2 L7.1 R44.1 R69.2 R70.2
SQUID_BIAS_Filtered: C13.1 C61.1 R41.2 ; port SQUID_BIAS_Filtered
NetC15_1: C15.1 R22.2 R23.1
NetC17_2: C17.2 R69.1 U1.5(IN+)
NetC19_2: C19.2 R14.2
NetC47_2: C47.2 R70.1 U1.3(IN+)
NetC48_2: C48.2 R49.2
NetC49_1: C49.1 R24.2 R25.1 R41.1
NetC50_1: C50.1 R26.2 R27.1
NetC52_2: C52.2 U7.1(IC)
NetC54_2: C54.2 L7.2 L8.1
NetL1_2: L1.2 R12.2 R13.2
NetL8_2: L8.2 R64.1 R65.2 U7.6(Vout)
NetL9_2: L9.2 R44.2 R45.2
NetR8_1: R8.1 R9.1 U1.6(IN-)
NetR8_2: R8.2 R13.1 R14.1 U1.7(OUT)
NetR22_1: R22.1 U4.4(Vout)
NetR24_1: R24.1 U3.4(Vout)
NetR26_1: R26.1 U6.4(Vout)
NetR40_1: R40.1 R43.1 U1.2(IN-)
NetR40_2: R40.2 R45.1 R49.1 U1.1(OUT)
NetR46_1: R46.1 U7.8(IC)
NetR47_2: R47.2 U7.3(TEMP)
NetR64_2: R64.2 U7.7(NC)

Not connected (* = marked no-connect by the designer): U3 2(NC) 3(NC); U4 2(NC) 3(NC); U6 2(NC) 3(NC); U7 5(TRIM)*

### Channels
CH1/REFS: designators end in _1; ports ANALOG_VREF=CH1_CRYO.SQUID_Sense_N FLUX_BIAS_Filtered=FLUX_BIAS_Filtered_CH1 OFFSET_Filtered=OFFSET_Filtered_CH1 SQUID_BIAS_Filtered=SQUID_BIAS_Filtered_CH1
CH2/REFS: designators end in _2; ports ANALOG_VREF=CH2_CRYO.SQUID_Sense_N FLUX_BIAS_Filtered=FLUX_BIAS_Filtered_CH2 OFFSET_Filtered=OFFSET_Filtered_CH2 SQUID_BIAS_Filtered=SQUID_BIAS_Filtered_CH2
CH3/REFS: designators end in _3; ports ANALOG_VREF=CH3_CRYO.SQUID_Sense_N FLUX_BIAS_Filtered=FLUX_BIAS_Filtered_CH3 OFFSET_Filtered=OFFSET_Filtered_CH3 SQUID_BIAS_Filtered=SQUID_BIAS_Filtered_CH3
CH4/REFS: designators end in _4; ports ANALOG_VREF=CH4_CRYO.SQUID_Sense_N FLUX_BIAS_Filtered=FLUX_BIAS_Filtered_CH4 OFFSET_Filtered=OFFSET_Filtered_CH4 SQUID_BIAS_Filtered=SQUID_BIAS_Filtered_CH4

### Notes on the sheet
- DAC AND ANALOG VOLTAGE REFERENCES
- (near C16) 2.5V*(1+11k/12k)=4.79V
- (near C16) Total capacitive load seen by L1 is 400nF giving 250kHz, is this low enough?
- 2.5V
- NOTE1:This circuit gererates the DAC and analog amplifier reference voltages and offer many configuration options to explore various alternatives, with or without op-amps.
  NOTE2: The DAC reference must be higher than the ANALOG_VREF if we want to be able to bias the SQUID and offset the preamp properly.
  NOTE3: DAC_VREF can be tied to the analog 5V rail (op-amp bypassed) or can be an amplified version of the  2.5V reference. The second option allows additional filtering, provides a lower source impedance, and provides some degree of tracking relative to the analog reference. The maximum voltage is limited by the rail headroom required by the op-amp (a rail-to-rail op-amp is required here). The maximum current load is about 2 mA.
  NOTE4: The analog VREF can be connected directly to the 2.5V reference (which must source or sink up to 4 mA with a very low impedance) or can be buffered (or scaled) by the op-amp. The advantages described above also apply here.
  NOTE5: reactive filtering is used to reduce the 1-10 MHz noise while maintaing a low DC impedance.
  NOTE6: The 1/f noise and offset temperature drift of the op-amp must be lower than the voltage reference
  NOTE7: A standard dual op-amp pad is used. We can use the LT1498 (better performance, 2 mA supply) or LT2078 (higher noise, 0.2 mA sypply). Both exist in Rad hard versions. Other amplifiers can be used for COTS. Note that amplifiers like LT1013 use a different SO8 pinout.
- (near C45) Total capacitive load seen by L9 is 300nF
- (near C48) (R49 & C48) ,(R14 & C19) provides compensation that allows us to drive much larger capacitance loads
- PRIMARY VOLTAGE REFERENCE
- These 10uH 0805 have 300 mOhms DCR
- (near C52) NOTE1: Sinks current to GND via 20k impedance
  NOTE2: Maximum current is 4.8V/(5K+5K+20K) =160 uA
  NOTE3: Cutoff frequency -3dB@ 101Hz (-40dB/Decade)
- (near C61) NOTE1: Sinks current to VREF via 4.22k impedance
  NOTE2: The pull-up offsets the output range of the DAC to ensure that the current into the SQUID is always positive.
  NOTE3: Output current is 0 -386 uA
  NOTE4: Cutoff frequency -3dB@ 350Hz (-40dB/Decade)
- NOTE1:Provides a temperature-stable voltage reference that is used to generate the DAC and analog ref.
  NOTE2: Low frequency (1/f) noise between 0.1 - 10 Hz is critical as it cannot be filtered effectively.
  NOTE3: The 1-10 MHz noise is also important but is filtered
  NOTE4: A typical voltage of 2.5V is used, although other voltages could be used since we amplify these.
  NOTE5: If the reference is used without buffering, the reference must SOURCE or SINK adequate current (a few mA) and provide a very low output impedance.
  NOTE6: The pad is compatible with the REF43 (COTS and Rad Hard) and the following COTS-only devices:  AD780, ADR440 and MAX6126
- (near C62) NOTE1: Sinks current to VREF via 105 Ohm impedance
  NOTE2: Current must be large enough to cancel the current generated by the SQUID into the 5 ohm resistor (i.e. 32 mV/5 ohms = 3.2 mA).
  NOTE3: Output current is ( [0 .. 4.8]V-2.5V) / 709 Ohms=  [+3.2 .. -3.5]mA
  NOTE4: Cutoff frequency -3dB@ 5.5kHz   (-40dB/Decade)
- File:
- Size:
- Date:
- Letter
- Revision:
- Sheet
- of
- Cosmology
- Drawn by:
- (in symbol LMH6628, part A) Vcc; -Vcc

### Library data of the parts
C11-C15 C18 C26 C39 C46 C49-C54 C61 C62 = Cap0603: as C22 on sheet SQUIDCtrl_Rev0; Supplier 1: Digi-Key; Supplier Part Number 1: 399-1096-1-ND
  C11-C15 C18 C26 C39 C46 C49-C51 C53 C54 C61 C62: Value: 0.1uF
  C52: Value: DNL
C16 C45 C60 = Cap0603: Capacitor, Ceramic, 0603; Manufacturer: Generic; Part Constraints: 0.1uF 16V 10% X7R; Supplier 1: Digi-Key; Supplier Part Number 1: 399-1096-1-ND; Value: 0.1uF
C17 C20 C21 C47 C67-C69 = Cap0603: as C6 on sheet SQUID_Channel; Value: 1nF; Supplier 1: Digi-Key; Supplier Part Number 1: 399-1082-1-ND
C19 C48 = Cap0603: Capacitor, Ceramic, 0603; Manufacturer: Generic; Part Constraints: CAP CER 10UF 10V 20% X5R 0603; Supplier 1: Digi-Key; Supplier Part Number 1: 587-2562-1-ND; Value: 10uF
C65 C66 = CAP 1210: as C63 on sheet SQUID_Channel; Footprint: 1210; Supplier 1: Digikey; Supplier Part Number 1: 478-1573-1-ND
L1 L9 = Inductor0603: Inductor 0603; PartConstraints: INDUCTOR 1.0UH 230MA 20% 0603; Manufacturer: TDK Corporation; Part Constraints: GLFR1608T1R0M-LR; Supplier 1: Digi-Key; Supplier Part Number 1: 445-3605-1-ND
L7 L8 = Inductor0603: Inductor 0805; PartConstraints: INDUCTOR 10UH 100MA 20% 0805; Manufacturer: TDK Corporation; Part Constraints: GLFR2012T100M-LR; Resistance: <300mOhm; CurrentRating: 100mA; Inductance: 10uH; Supplier 1: Digi-Key; Supplier Part Number 1: 445-3614-1-ND
R8 = Res0603: RES 0603; Manufacturer: Generic; Part Constraints: RES 11.0K OHM 1/10W 1% 0603 SMD; Manufacturer Part Number 1: e.g CRCW0603 series; Value: 11k; Supplier 1: Digi-Key; Supplier Part Number 1: 541-11.0KHCT-ND
R9 = RES 0603: Manufacturer: Generic; Part Constraints: RES 12.0K OHM 1/10W 1% 0603 SMD; Manufacturer Part Number 1: e.g CRCW0603 series; Value: 12k; Supplier 1: Digi-Key; Supplier Part Number 1: 541-12.0KHCT-ND
R12 R44 = Res0603: as R21 on sheet SQUID_Channel; Value: DNL; Part constraints: DNL
R13 R40 R45 = Res0603: as R11 on sheet SQUID_Channel; Value: 0; Supplier 1: Digi-Key; Supplier Part Number 1: 541-0.0GCT-ND
R14 = Res0603: RES 0603; Manufacturer: Generic; Part constraints: RES 4.99 OHM 1/10W 1% 0603 SMD; Manufacturer Part Number 1: e.g CRCW0603 series; Value: 4.99; Supplier 1: Digi-Key; Supplier Part Number 1: 541-4.99HHCT-ND
R22 R23 = Res0603: RES 0603; Manufacturer: Generic; Part constraints: RES 4.99K OHM 1/10W 1% 0603 SMD; Manufacturer Part Number 1: e.g CRCW0603 series; Value: 4.99k; Supplier 1: Digi-Key; Supplier Part Number 1: 541-4.99KHCT-ND
R24 R25 = Res0603: RES 0603; Manufacturer: Generic; Part constraints: RES 2.00K OHM 1/10W 1% 0603 SMD; Manufacturer Part Number 1: e.g CRCW0603 series; Supplier 1: Digi-Key; Supplier Part Number 1: 541-2.00KHCT-ND
  R24: Value: 2K
  R25: Value: 2k
R26 = Res0603: RES 0603; Manufacturer: Generic; Manufacturer Part Number 1: e.g CRCW0603 series; Part constraints: 499 1/10W 1% 100ppm/C 0603; Value: 499; Supplier 1: Digi-Key; Supplier Part Number 1: 541-499HCT-ND
R27 = Res0603: RES 0603; Manufacturer: Generic; Manufacturer Part Number 1: e.g CRCW0603 series; Part constraints: RES 100 OHM 1/10W 1% 0603 SMD; Value: 100; Supplier 1: Digi-Key; Supplier Part Number 1: 541-100HCT-ND
R41 = Res0603: RES 0603; Manufacturer: Generic; Part constraints: 1K 1/10W 1% 100ppm/C 0603; Manufacturer Part Number 1: e.g CRCW0603 series; Value: 1K; Supplier 1: Digi-Key; Supplier Part Number 1: 541-1.00KHTR-ND
R43 R47 R65 = RES 0603: as R18 on sheet SQUIDCtrl_Rev0; Value: DNL; Part constraints: DNL
R46 = RES 0603: Manufacturer: Generic; Manufacturer Part Number 1: e.g CRCW0603 series; Tolerance: 1%; Power: 1/10W; TempCoef: 100ppm/C; Value: DNL; Part Constraints: DNL
R49 = Res0603: RES 0603; Manufacturer: Generic; Part Constraints: RES 4.99 OHM 1/10W 1% 0603 SMD; Manufacturer Part Number 1: e.g CRCW0603 series; Value: 4.99; Supplier 1: Digi-Key; Supplier Part Number 1: 541-4.99HHCT-ND
R64 = RES 0603: as R17 on sheet SQUIDCtrl_Rev0; Value: DNL; Supplier 1: Digi-Key; Supplier Part Number 1: 541-0.0GCT-ND
R69 R70 = Res0603: RES 0603; Manufacturer: Generic; Part Constraints: RES 5.76K OHM 1/10W 1% 0603 SMD; Manufacturer Part Number 1: e.g CRCW0603 series; Value: 5.76k; Supplier 1: Digi-Key; Supplier Part Number 1: 541-5.76KHCT-ND
U1 = LMH6628: IC OP AMP DUAL 2CH LN 8-SOIC; Manufacturer: National Semiconductor; Amplifier Type: Voltage Feedback; Number of Circuits: 2; Category: Integrated Circuits (ICs); Output Type: -; Operating Temperature: -40°C ~ 85°C; Mounting Type: Surface Mount; Package / Case: 8-SOIC (0.154", 3.90mm Width); Supplier Device Package: 8-SOIC; Packaging: Tube; Supplier 1: Digi-Key; Supplier Part Number 1: LT1498IS8#PBF-ND; Part Constraints: LT1498IS8#PBF-ND
U3 U4 U6 = DAC121S101CIMM/NOPB: CONV D/A 12BIT MICROPWR 8MSOP; Manufacturer: National Semiconductor; Settling Time: 12µs; Number of Bits: 12; Data Interface: DSP, MICROWIRE™, QSPI™, Serial, SPI™; Number of Converters: 1; Voltage Supply Source: Single Supply; Power Dissipation (Max): 1.72mW; Number of Outputs and Type: 1 Voltage, Unipolar; 1 Voltage, Bipolar; RoHS: RoHS Compliant; Category: Integrated Circuits (ICs); Stock 1: 3011; Pricing 1: 1=3.5, 25=2.8616, 100=2.5698, 250=2.33624, 500=2.0442 (CAD); Operating Temperature: -40°C ~ 105°C; Mounting Type: Surface Mount; Package / Case: 8-TSSOP, 8-MSOP (0.118", 3.00mm Width); Supplier Device Package: 8-MSOP; Packaging: Cut Tape (CT); Sampling Rate (Per Second): *; ComponentLink1URL: http://www.ti.com/lit/ds/symlink/dac121s101.pdf; ComponentLink1Description: http://www.ti.com/lit/ds/symlink/dac121s101.pdf; Supplier 1: Digi-Key; Supplier Part Number 1: DAC121S101CIMMCT-ND; Part Constraints: DAC121S101CIMM/NOPB
U7 = REF43: Voltage Referance; Part Constraints: REF43GSZ; Supplier 1: Digi-Key; Supplier Part Number 1: REF43GSZ-ND

## Sheet Power.SchDoc: Power and Mechanical
size Letter; DrawnBy: Adam Gilbert; Engineer: J.-F. Cliche; DocumentNumber: 4; Revision: Rev0; SheetNumber: 4; SheetTotal: 5; ProjectTitle: DAN Squid Controller
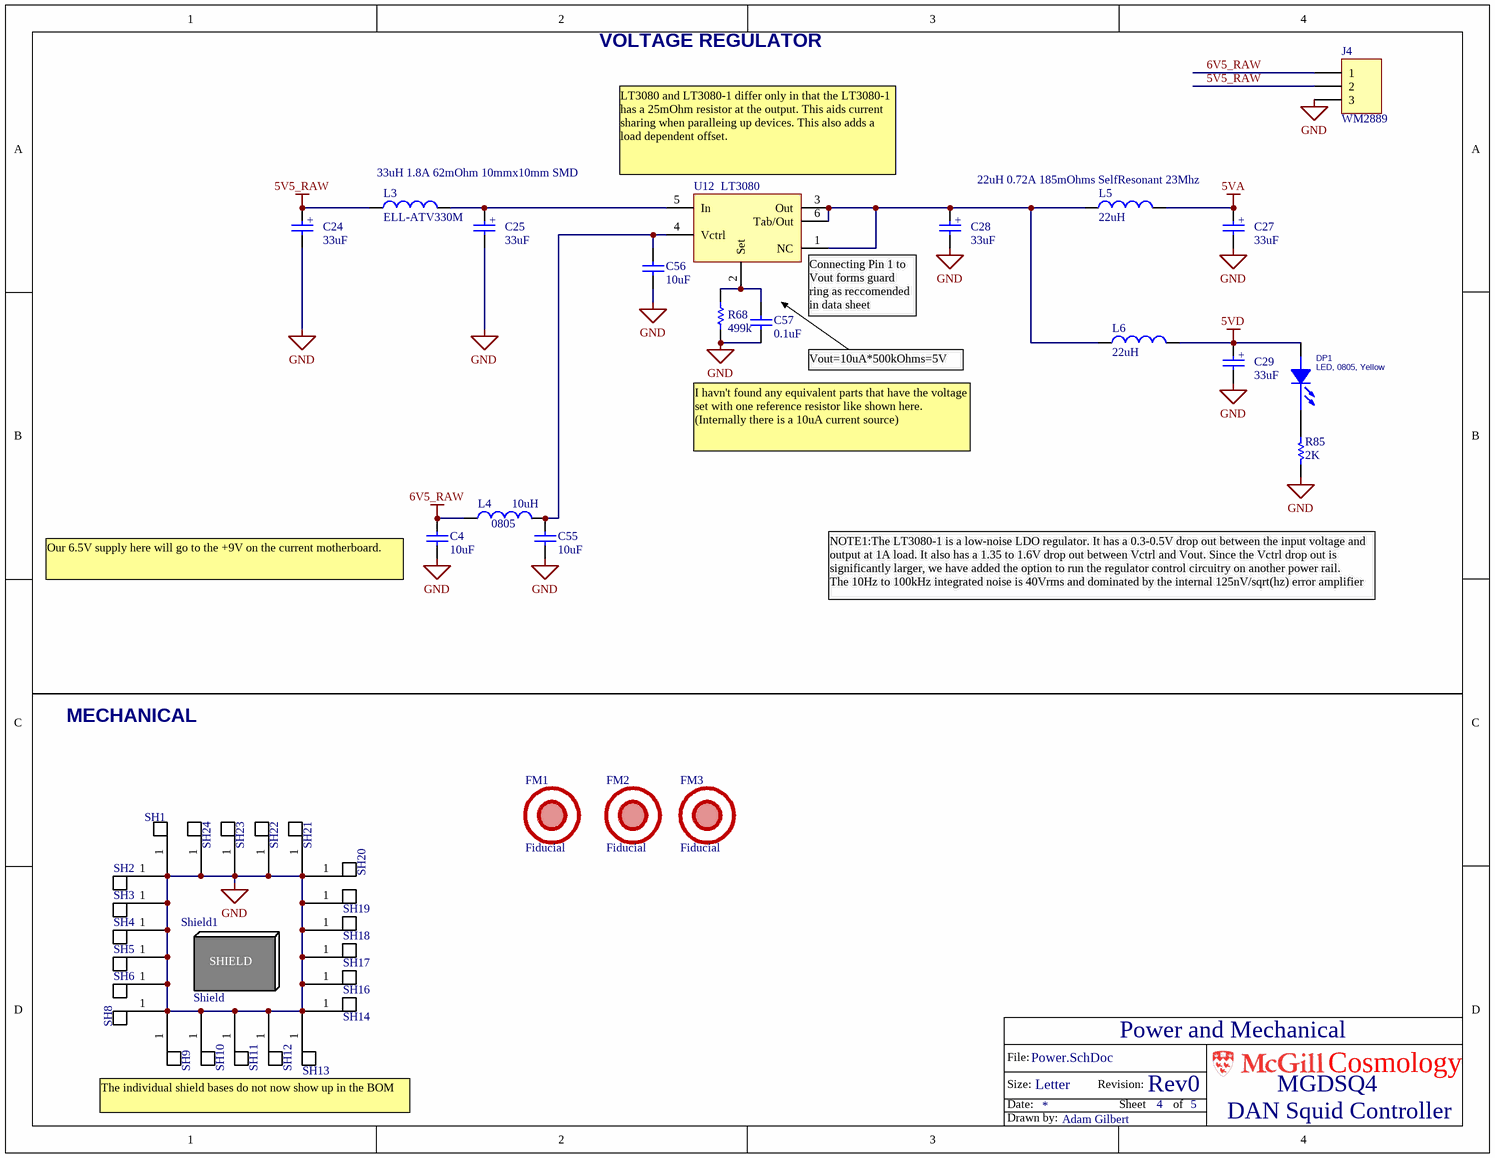
[diagram p3: Power.SchDoc]

### Parts
C4  10uF  [0603]
C24  33uF  [TCASE-D]
C25  33uF  [TCASE-D]
C27  33uF  [TCASE-D]
C28  33uF  [TCASE-D]
C29  33uF  [TCASE-D]
C55  10uF  [0603]
C56  10uF  [0603]
C57  0.1uF  [0603]
DP1  LED, 0805, Yellow  [0805L]
FM1  Fiducial  [Fiducial_mark]  (no BOM)
FM2  Fiducial  [Fiducial_mark]  (no BOM)
FM3  Fiducial  [Fiducial_mark]  (no BOM)
J4  WM2889  [HDR1X3_MolexVertical]
L3  ELL-ATV330M  Description: 33uH 1.8A 62mOhm 10mmx10mm SMD  [ELLATV]
L4  10uH  [0805]
L5  22uH  PartConstraints: 22uH 0.72A 185mOhms SelfResonant 23Mhz  [SRR4028]
L6  22uH  [SRR4028]
R68  499k  [0603]
R85  2k  [0603]
SH1  LeaderTech 20S-CBS-2x0.5x0.2 - DIVIDE QUANITY REQURIED BY 10!  [SHIELD BASE CORNER]  (value not drawn)  (no BOM)
SH2  LeaderTech 20S-CBS-2x0.5x0.2 - DIVIDE QUANITY REQURIED BY 10!  [SHIELD BASE]  (value not drawn)  (no BOM)
SH3  LeaderTech 20S-CBS-2x0.5x0.2 - DIVIDE QUANITY REQURIED BY 10!  [SHIELD BASE]  (value not drawn)  (no BOM)
SH4  LeaderTech 20S-CBS-2x0.5x0.2 - DIVIDE QUANITY REQURIED BY 10!  [SHIELD BASE]  (value not drawn)  (no BOM)
SH5  LeaderTech 20S-CBS-2x0.5x0.2 - DIVIDE QUANITY REQURIED BY 10!  [SHIELD BASE]  (value not drawn)  (no BOM)
SH6  LeaderTech 20S-CBS-2x0.5x0.2 - DIVIDE QUANITY REQURIED BY 10!  [SHIELD BASE]  (value not drawn)  (no BOM)
SH8  LeaderTech 20S-CBS-2x0.5x0.2 - DIVIDE QUANITY REQURIED BY 10!  [SHIELD BASE CORNER]  (value not drawn)  (no BOM)
SH9  LeaderTech 20S-CBS-2x0.5x0.2 - DIVIDE QUANITY REQURIED BY 10!  [SHIELD BASE]  (value not drawn)  (no BOM)
SH10  LeaderTech 20S-CBS-2x0.5x0.2 - DIVIDE QUANITY REQURIED BY 10!  [SHIELD BASE]  (value not drawn)  (no BOM)
SH11  LeaderTech 20S-CBS-2x0.5x0.2 - DIVIDE QUANITY REQURIED BY 10!  [SHIELD BASE]  (value not drawn)  (no BOM)
SH12  LeaderTech 20S-CBS-2x0.5x0.2 - DIVIDE QUANITY REQURIED BY 10!  [SHIELD BASE]  (value not drawn)  (no BOM)
SH13  LeaderTech 20S-CBS-2x0.5x0.2 - DIVIDE QUANITY REQURIED BY 10!  [SHIELD BASE CORNER]  (value not drawn)  (no BOM)
SH14  LeaderTech 20S-CBS-2x0.5x0.2 - DIVIDE QUANITY REQURIED BY 10!  [SHIELD BASE]  (value not drawn)  (no BOM)
SH16  LeaderTech 20S-CBS-2x0.5x0.2 - DIVIDE QUANITY REQURIED BY 10!  [SHIELD BASE]  (value not drawn)  (no BOM)
SH17  LeaderTech 20S-CBS-2x0.5x0.2 - DIVIDE QUANITY REQURIED BY 10!  [SHIELD BASE]  (value not drawn)  (no BOM)
SH18  LeaderTech 20S-CBS-2x0.5x0.2 - DIVIDE QUANITY REQURIED BY 10!  [SHIELD BASE]  (value not drawn)  (no BOM)
SH19  LeaderTech 20S-CBS-2x0.5x0.2 - DIVIDE QUANITY REQURIED BY 10!  [SHIELD BASE]  (value not drawn)  (no BOM)
SH20  LeaderTech 20S-CBS-2x0.5x0.2 - DIVIDE QUANITY REQURIED BY 10!  [SHIELD BASE CORNER]  (value not drawn)  (no BOM)
SH21  LeaderTech 20S-CBS-2x0.5x0.2 - DIVIDE QUANITY REQURIED BY 10!  [SHIELD BASE]  (value not drawn)  (no BOM)
SH22  LeaderTech 20S-CBS-2x0.5x0.2 - DIVIDE QUANITY REQURIED BY 10!  [SHIELD BASE]  (value not drawn)  (no BOM)
SH23  LeaderTech 20S-CBS-2x0.5x0.2 - DIVIDE QUANITY REQURIED BY 10!  [SHIELD BASE]  (value not drawn)  (no BOM)
SH24  LeaderTech 20S-CBS-2x0.5x0.2 - DIVIDE QUANITY REQURIED BY 10!  [SHIELD BASE]  (value not drawn)  (no BOM)
Shield1  Shield
U12  LT3080  [D2-PAK-6_LT3080]

### Nets
5V5_RAW: C24.1 J4.2 L3.1
5VA: C27.1 L5.2
5VD: C29.1 DP1.1(ANODE) L6.2
6V5_RAW: C4.2 J4.1 L4.2
GND: C4.1 C24.2 C25.2 C27.2 C28.2 C29.2 C55.1 C56.1 C57.1 J4.3 R68.1 R85.2 SH1.1 SH2.1 SH3.1 SH4.1 SH5.1 SH6.1 SH8.1 SH9.1 SH10.1 SH11.1 SH12.1 SH13.1 SH14.1 SH16.1 SH17.1 SH18.1 SH19.1 SH20.1 SH21.1 SH22.1 SH23.1 SH24.1
NetC25_1: C25.1 L3.2 U12.5(In)
NetC28_1: C28.1 L5.1 L6.1 U12.1(NC) U12.3(Out) U12.6(Tab/Out)
NetC55_2: C55.2 C56.2 L4.1 U12.4(Vctrl)
NetC57_2: C57.2 R68.2 U12.2(Set)
NetDP1_2: DP1.2(CATHODE) R85.1

### Notes on the sheet
- VOLTAGE REGULATOR
- (near U12) LT3080 and LT3080-1 differ only in that the LT3080-1 has a 25mOhm resistor at the output. This aids current sharing when paralleing up devices. This also adds a load dependent offset.
- (near C57) Vout=10uA*500kOhms=5V
- (near U12) Connecting Pin 1 to Vout forms guard ring as reccomended in data sheet
- I havn't found any equivalent parts that have the voltage set with one reference resistor like shown here. (Internally there is a 10uA current source)
- (near C4) Our 6.5V supply here will go to the +9V on the current motherboard.
- NOTE1:The LT3080-1 is a low-noise LDO regulator. It has a 0.3-0.5V drop out between the input voltage and output at 1A load. It also has a 1.35 to 1.6V drop out between Vctrl and Vout. Since the Vctrl drop out is significantly larger, we have added the option to run the regulator control circuitry on another power rail.
  The 10Hz to 100kHz integrated noise is 40Vrms and dominated by the internal 125nV/sqrt(hz) error amplifier
- MECHANICAL
- The individual shield bases do not now show up in the BOM
- File:
- Size:
- Date:
- Letter
- Revision:
- Sheet
- of
- Cosmology
- Drawn by:
- (in symbol SHIELD 20S-CBS-3x2.5x0.2) SHIELD
- (in symbol Tantalum) +

### Library data of the parts
C4 C55 C56 = Cap0603: as C19 on sheet SQUID_Channel_DACS; Supplier 1: Digi-Key; Supplier Part Number 1: 587-2562-1-ND; Value: 10uF
C24 C25 C27-C29 = Tantalum: CAP TANT CASE-D; Manufacturer: Generic; Part Constraints: CAP TANT 33UF 16V 20% 2917; Voltage: 16V; ESR: 100mOhms; Footprint: D; Value: 33uF; Supplier 1: Digi-Key
  C24: Supplier Part Number 1: 399-4738-2-ND; Supplier 2: Digi-Key; Supplier Part Number 2: 399-4738-1-ND
  C25 C27-C29: Supplier Part Number 1: 399-4738-1-ND
C57 = Cap0603: as C22 on sheet SQUIDCtrl_Rev0; Supplier 1: Digi-Key; Supplier Part Number 1: 399-1096-1-ND; Value: 0.1uF
DP1 = LED, yellow, 0805, 2mA: LED; Part Constraints: 511-1293-1-ND; Supplier 1: Digi-Key; Supplier Part Number 1: 511-1293-1-ND
J4 = Header 3: 3-Pin 0.1" header; Manufacturer: Digikey; Part Constraints: WM2889; Supplier 1: Molex; Supplier Part Number 1: WM2889-ND
L3 = ELL-ATV330M: 33uH 1.8A inductor 10mmx10mm; Manufacturer: Panasonic - ECG; Inductance: 33µH; Type: Ferrite Core; Tolerance: ±20%; Shielding: Shielded; DC Resistance (DCR): 62 mOhm; Frequency - Test: 100kHz; RoHS: RoHS Compliant; Category: Inductors, Coils, Chokes; Stock 1: 6281; Pricing 1: 1=2.28, 10=2.15, 50=2.0154, 100=1.8811 (CAD); Current: 1.8A; Current - Saturation: -; Current - Temperature Rise: -; Q @ Freq: -; Frequency - Self Resonant: -; Applications: General Purpose; Material - Core: -; Package / Case: 0.394" L x 0.394" W x 0.177" H (10.00mm x 10.00mm x 4.50mm); Mounting Type: Surface Mount; Packaging: Cut Tape (CT); Operating Temperature: -; ComponentLink1URL: http://industrial.panasonic.com/www-cgi/jvcr13pz.cgi?E+PZ+2+AGM0010+0+4+WW; ComponentLink1Description: http://industrial.panasonic.com/www-cgi/jvcr13pz.cgi?E+PZ+2+AGM0010+0+4+WW; Supplier 1: Digi-Key; Supplier Part Number 1: PCD1754CT-ND; Part Constraints: ELL-ATV330M
L4 = Inductor0603: as L7 on sheet SQUID_Channel_DACS; Inductance: 10uH; Supplier 1: Digi-Key; Supplier Part Number 1: 445-3614-1-ND
L5 = InductorSRR4028: =PartConstraints; Manufacturer: Bourns; Part Constraints: SRR4028-220YCT-ND; Resistance: 185mOhms; CurrentRating: 0.72A; SRF: SelfResonant 23Mhz; Inductance: 22uH; Supplier 1: Digi-Key; Supplier Part Number 1: SRR4028-220YCT-ND
L6 = InductorSRR4028: =PartConstraints; Manufacturer: Bourns; PartConstraints: 22uH 0.72A 185mOhms SelfResonant 23Mhz; Part Constraints: SRR4028-220YCT-ND; Resistance: 185mOhms; CurrentRating: 0.72A; SRF: SelfResonant 23Mhz; Inductance: 22uH; Supplier 1: Digi-Key; Supplier Part Number 1: SRR4028-220YCT-ND
R68 = RES 0603: Manufacturer: Generic; Manufacturer Part Number 1: e.g CRCW0603 series; Part constraints: 499k 1/10W 1% 100ppm/C 0603; Value: 499k; Supplier 1: Digi-Key; Supplier Part Number 1: 541-499KHCT-ND
R85 = Res0603: as R24 on sheet SQUID_Channel_DACS; Value: 2K; Supplier 1: Digi-Key; Supplier Part Number 1: 541-2.00KHCT-ND
SH1-SH6 SH8-SH14 SH16-SH24 = ShieldBase: Part Constraints: 20S-CBS-3x2.5x0.2  (divide quantity by 22); Manufacturer: LeaderTech; Supplier 1: LeaderTech; Supplier Part Number 1: 20S-CBS-3x2.5x0.2  (divide quantity by 22)
Shield1 = SHIELD 20S-CBS-3x2.5x0.2: 20S-CBSA-3x2.5x0.2 (assembled fence and cover); Manufacturer: Leadertech; Supplier 1: Leadertech; Supplier Part Number 1: 20S-CBSA-3x2.5x0.2 (assembled fence and cover); Part Constraints: 20S-CBSA-3x2.5x0.2 (assembled fence and cover)
U12 = LT3080: Low dropout regulator, single resistor, 1.1A; Manufacturer: Linear Technology; Supplier 1: Digi-Key; Supplier Part Number 1: LT3080EQ#PBF-ND; Part Constraints: D2-PAK-6_LT3080